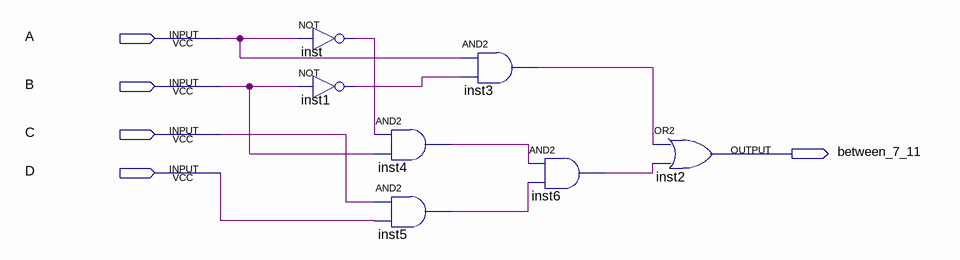
[diagram p0: schematic sheet]
// Quartus schematic between7_and_11.bdf as structural Verilog: 7 symbols, 5 pins
module between7_and_11 (
  input  A,
  input  B,
  input  C,
  input  D,
  output between_7_11
);

  wire inst1_out, inst3_out, inst4_out, inst5_out, inst6_out, inst_out;

  not inst (inst_out, A);
  not inst1 (inst1_out, B);
  and inst4 (inst4_out, inst_out, B);
  and inst5 (inst5_out, C, D);
  and inst3 (inst3_out, A, inst1_out);
  and inst6 (inst6_out, inst4_out, inst5_out);
  or inst2 (between_7_11, inst3_out, inst6_out);
endmodule
